# Altium schematic sheet LV8731.SchDoc: LV8731
size A4; Author: SchumyHao; DocumentNumber: 2; Revision: V01; SheetNumber: 2; SheetTotal: 7
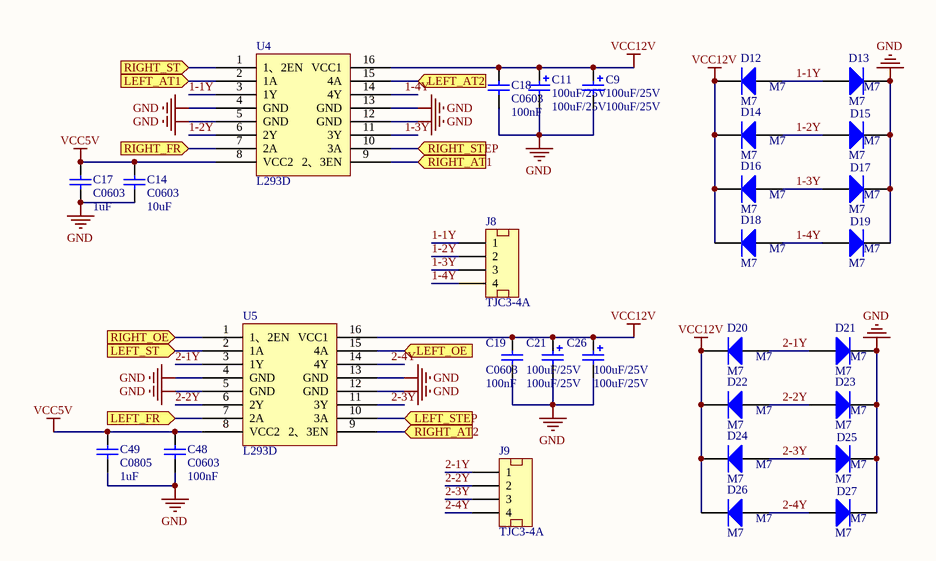
[diagram p0: LV8731.SchDoc]

## Parts
C9  100uF/25V  [16V220uF]
C11  100uF/25V  [16V220uF]
C14  C0603  value 10uF  [C0603]
C17  C0603  value 1uF  [C0805]
C18  C0603  value 100nF  [C0603]
C19  C0603  value 100nF  [C0603]
C21  100uF/25V  [16V220uF]
C26  100uF/25V  [16V220uF]
C48  C0603  value 100nF  [C0603]
C49  C0805  value 1uF  [C0805]
D12  M7  [403D_02]
D13  M7  [403D_02]
D14  M7  [403D_02]
D15  M7  [403D_02]
D16  M7  [403D_02]
D17  M7  [403D_02]
D18  M7  [403D_02]
D19  M7  [403D_02]
D20  M7  [403D_02]
D21  M7  [403D_02]
D22  M7  [403D_02]
D23  M7  [403D_02]
D24  M7  [403D_02]
D25  M7  [403D_02]
D26  M7  [403D_02]
D27  M7  [403D_02]
J8  TJC3-4A  [TJC3-4A]
J9  TJC3-4A  [TJC3-4A]
U4  L293D  [DIP16]
U5  L293D  [DIP16]

## Ports
LEFT_AT1 (in), LEFT_AT2 (in), LEFT_FR (in), LEFT_OE (in), LEFT_ST (in), LEFT_STEP (in), RIGHT_AT1 (in), RIGHT_AT2 (in), RIGHT_FR (in), RIGHT_OE (in), RIGHT_ST (in), RIGHT_STEP (in)

## Nets
GND: C9.2 C11.2 C14.2 C17.1 C18.1 C19.1 C21.2 C26.2 C48.1 C49.1 D13.2(K) D15.2(K) D17.2(K) D19.2(K) D21.2(K) D23.2(K) D25.2(K) D27.2(K) U4.4(GND) U4.5(GND) U4.12(GND) U4.13(GND) U5.4(GND) U5.5(GND) U5.12(GND) U5.13(GND)
VCC5V: C14.1 C17.2 C48.2 C49.2 U4.8(VCC2) U5.8(VCC2)
VCC12V: C9.1 C11.1 C18.2 C19.2 C21.1 C26.1 D12.2(K) D14.2(K) D16.2(K) D18.2(K) D20.2(K) D22.2(K) D24.2(K) D26.2(K) U4.16(VCC1) U5.16(VCC1)
1-1Y: D12.1(A) D13.1(A) J8.1 U4.3(1Y)
1-2Y: D14.1(A) D15.1(A) J8.2 U4.6(2Y)
1-3Y: D16.1(A) D17.1(A) J8.3 U4.11(3Y)
1-4Y: D18.1(A) D19.1(A) J8.4 U4.14(4Y)
2-1Y: D20.1(A) D21.1(A) J9.1 U5.3(1Y)
2-2Y: D22.1(A) D23.1(A) J9.2 U5.6(2Y)
2-3Y: D24.1(A) D25.1(A) J9.3 U5.11(3Y)
2-4Y: D26.1(A) D27.1(A) J9.4 U5.14(4Y)
LEFT_AT1: U4.2(1A) ; port LEFT_AT1
LEFT_AT2: U4.15(4A) ; port LEFT_AT2
LEFT_FR: U5.7(2A) ; port LEFT_FR
LEFT_OE: U5.15(4A) ; port LEFT_OE
LEFT_ST: U5.2(1A) ; port LEFT_ST
LEFT_STEP: U5.10(3A) ; port LEFT_STEP
RIGHT_AT1: U4.9(2、3EN) ; port RIGHT_AT1
RIGHT_AT2: U5.9(2、3EN) ; port RIGHT_AT2
RIGHT_FR: U4.7(2A) ; port RIGHT_FR
RIGHT_OE: U5.1(1、2EN) ; port RIGHT_OE
RIGHT_ST: U4.1(1、2EN) ; port RIGHT_ST
RIGHT_STEP: U4.10(3A) ; port RIGHT_STEP

## Notes on the sheet
- Title
- Size:
- Date:
- A4
- Number:
- Time:
- Revision:
- Sheet
- of
- File:

## Library data of the parts
C9 C11 C21 C26 = Cap Pol3: Polarized Capacitor (Surface Mount); Value: 100uF/25V
C14 C17-C19 C48 C49 = Cap Semi: Capacitor (Semiconductor SIM Model)
D12-D27 = Diode: Default Diode; Published: 8-Jun-2000; LatestRevisionDate: 17-Jul-2002; LatestRevisionNote: Re-released for DXP Platform.; PackageVersion: Sep-1996; PackageReference: SMC; Publisher: Altium Limited; Code_JEDEC: DO-214-AB; Value: M7
J8 J9 = TJC3-4A: Set Position: 0.5; Published: 8-Jun-2000; LatestRevisionDate: 17-Jul-2002; LatestRevisionNote: Re-released for DXP Platform.; PackageReference: AXIAL-0.6; Publisher: Altium Limited
U4 U5 = L293D: Value: L293D